# EAGLE design Puzzle_Interface (EAGLE 9.5.0)
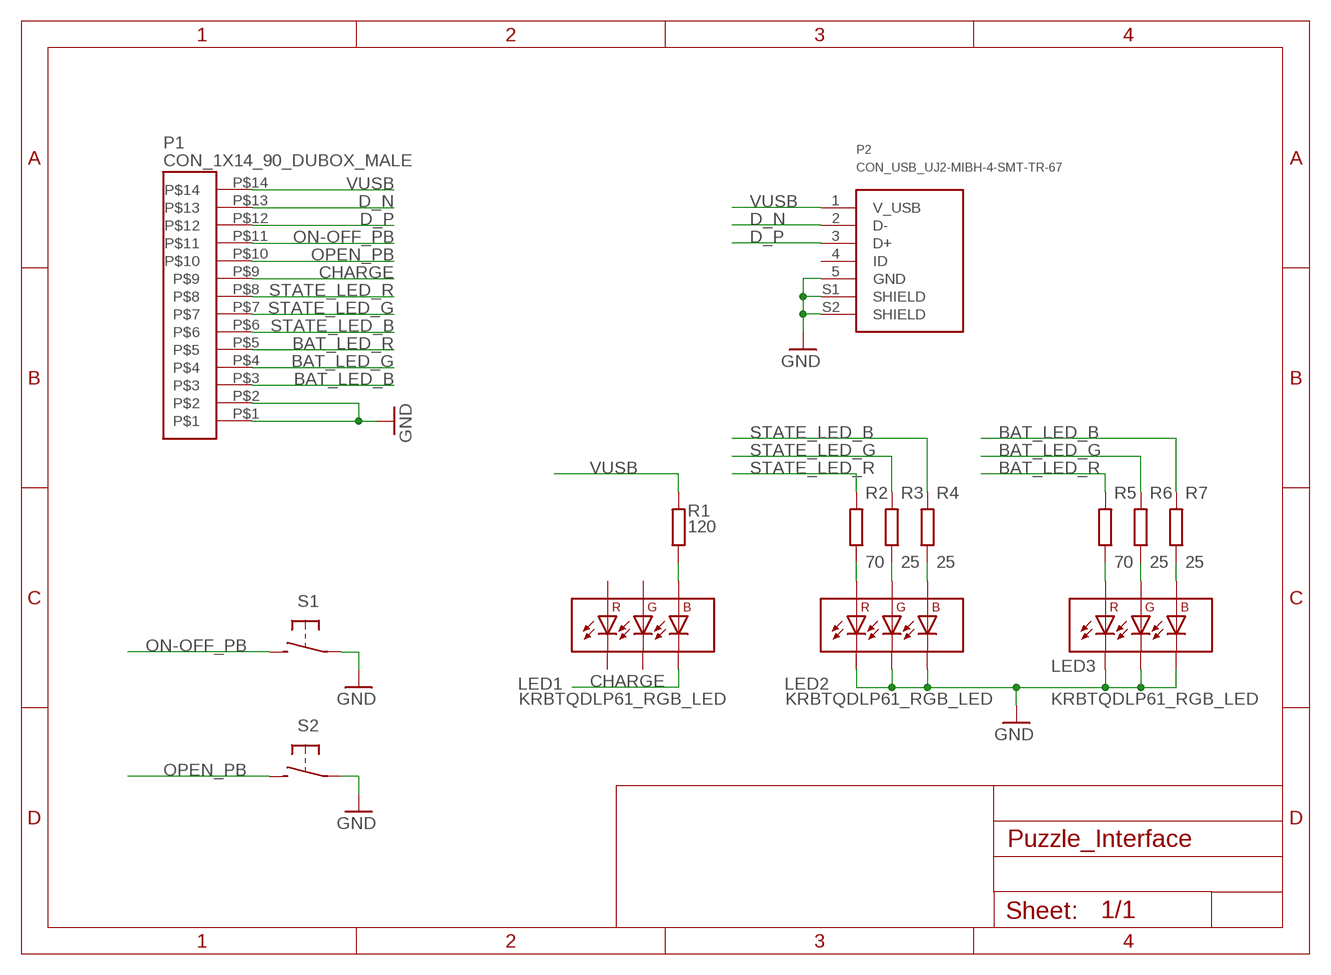
[diagram p0: schematic, sheet 1]

## Parts
LED1  KRBTQDLP61_RGB_LED  [KRBTQDLP61_RGB_LED]
LED2  KRBTQDLP61_RGB_LED  [KRBTQDLP61_RGB_LED]
LED3  KRBTQDLP61_RGB_LED  [KRBTQDLP61_RGB_LED]
P1  CON_1X14_90_DUBOX_MALE  [CON_1X14_90_DUBOX_MALE]
P2  CON_USB_UJ2-MIBH-4-SMT-TR-67  [CON_USB_UJ2-MIBH-4-SMT-TR-67]
R1  120  RES_0603  [0603]
R2  70  RES_0603  [0603]
R3  25  RES_0603  [0603]
R4  25  RES_0603  [0603]
R5  70  RES_0603  [0603]
R6  25  RES_0603  [0603]
R7  25  RES_0603  [0603]
S1  EG5358CT-ND_PB  [EG5358CT-ND_PB]
S2  EG5358CT-ND_PB  [EG5358CT-ND_PB]

## Nets
BAT_LED_B: P1.P$3 R7.2
BAT_LED_G: P1.P$4 R6.2
BAT_LED_R: P1.P$5 R5.2
CHARGE: LED1.P$4(BC) P1.P$9
D_N: P1.P$13 P2.2(D-)
D_P: P1.P$12 P2.3(D+)
GND: LED2.P$3(GC) LED2.P$4(BC) LED2.P$6(RC) LED3.P$3(GC) LED3.P$4(BC) LED3.P$6(RC) P1.P$1 P1.P$2 P2.5(GND) P2.S1(SHIELD) P2.S2(SHIELD) S1.1(P) S1.S1(P) S1.S2(P) S2.1(P) S2.S1(P) S2.S2(P)
N$1: LED1.P$2(BA) R1.1
N$5: LED2.P$5(RA) R2.1
N$6: LED2.P$1(GA) R3.1
N$7: LED2.P$2(BA) R4.1
N$11: LED3.P$5(RA) R5.1
N$12: LED3.P$1(GA) R6.1
N$13: LED3.P$2(BA) R7.1
ON-OFF_PB: P1.P$11 S1.2(S)
OPEN_PB: P1.P$10 S2.2(S)
STATE_LED_B: P1.P$6 R4.2
STATE_LED_G: P1.P$7 R3.2
STATE_LED_R: P1.P$8 R2.2
VUSB: P1.P$14 P2.1(V_USB) R1.2
Unconnected: LED1.P$1(GA) LED1.P$3(GC) LED1.P$5(RA) LED1.P$6(RC) P2.4(ID)

## Library data of the parts
LED1-LED3 = ZHAW_BA:KRBTQDLP61_RGB_LED: RGB LED, 2,1V Rot, 3,2V Grün, 2,9V Blau @ 20mA KRBT QDLP61.3A-5B5C-CF DigiKey: Pt.Nr: 475-3482-1-ND https://www.digikey.ch/product-detail/de/osram-opto-semiconductors-inc/KRBT-QDLP61-3A-5B5C-CF/475-3482-1-ND/7907970
P1 = ZHAW_BA:CON_1X14_90_DUBOX_MALE: Dubox, 1x14Pin, 2.54 Raster DigiKey: Pt.Nr: 609-1290-ND https://www.digikey.ch/product-detail/de/amphenol-icc-fci/76382-314LF/609-1290-ND/1001604 NOTE: Gegenstück: 65240-014LF
P2 = ZHAW_BA:CON_USB_UJ2-MIBH-4-SMT-TR-67: Micro B USB Buchse, 90° PCB Mount UJ2-MIBH-4-SMT-TR-67 DigiKey: Pt.Nr: 102-4970-1-ND https://www.digikey.ch/product-detail/de/cui-devices/UJ2-MIBH-4-SMT-TR-67/102-4970-1-ND/9564435
R1-R7 = ZHAW_BA:RES_0603: Resistor, 0603, 0.1 W, +-1%
S1 S2 = ZHAW_BA:EG5358CT-ND_PB: Push Button, 90° PCB Mount, TL3360CF185Q DigiKey: Pt.Nr: EG5358CT-ND https://www.digikey.ch/product-detail/de/e-switch/TL3360CF185Q/EG5358CT-ND/5816203

## Board
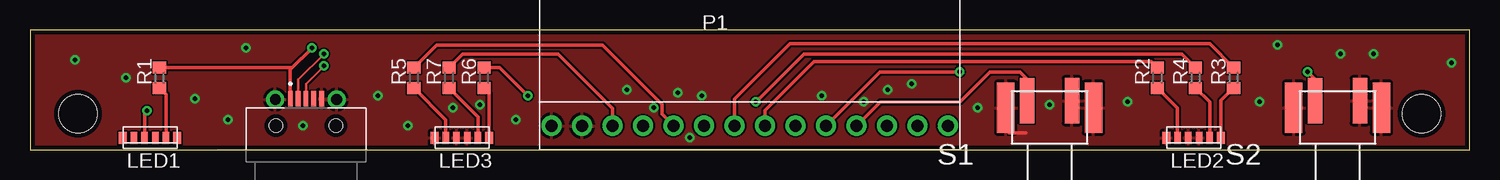
[diagram p1: board, top side]
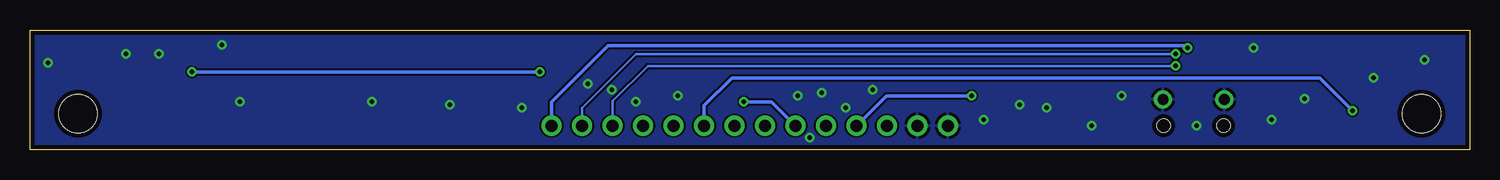
[diagram p2: board, bottom side, seen from below]

Size 120 x 10 mm. Coordinates in mm from the lower left corner, seen from the top.
Outline: 0,0 120,0 120,10 0,10 0,0
Copper layers (1*16): Top 0.035mm / dielectric 1.5mm / Bottom 0.035mm
Design rules "default *": minimum track width 6mil, minimum drill 0.35mm, track to track 6mil, track to pad 6mil, pad to pad 6mil, via to via 6mil, smd to smd 4mil, copper to edge 15mil, drill to drill 5mil, minimum pad ring 10mil, minimum via ring 8mil, stop-mask expansion 4mil, vias tented up to drill 0mil, thermal gap 10mil
Holes 3.2 mm at 4,3 116,3

### Footprints (pad centres in the part's own frame; a part is rotated, then mirrored left to right if it is on the bottom)
KRBTQDLP61_RGB_LED = smd 0.65 x 1: P$1 -2.275,0; P$6 2.275,0 | smd 0.55 x 1: P$2 -1.335,0; P$3 -0.445,0; P$4 0.445,0; P$5 1.335,0
CON_1X14_90_DUBOX_MALE = drill 1 pad 1.676: P$1 -16.51,0; P$2 -13.97,0; P$3 -11.43,0; P$4 -8.89,0; P$5 -6.35,0; P$6 -3.81,0; P$7 -1.27,0; P$8 1.27,0; P$9 3.81,0; P$10 6.35,0; P$11 8.89,0; P$12 11.43,0; P$13 13.97,0; P$14 16.51,0
CON_USB_UJ2-MIBH-4-SMT-TR-67 = smd 1.3 x 0.4: 1 4.25,1.3; 2 4.25,0.65; 3 4.25,0; 4 4.25,-0.65; 5 4.25,-1.3 | drill 0.9 pad 1.5: S1 4.2,2.55; S2 4.2,-2.55 | hole 1.1: 2,2.5; 2,-2.5
0603 = smd 1 x 1.1: 1 -0.85,0; 2 0.85,0
EG5358CT-ND_PB = smd 1.2 x 3.76: 1 -1.87,-3.58; 2 1.87,-3.58 | smd 1.46 x 4.19: S1 -3.65,-3; S2 3.65,-3

### Placement (x,y rotation side)
LED1  10,1 180 top
LED2  97,1 180 top
LED3  36,1 180 top
P1  60,2 0 top
P2  23,0 90 top
R1  10.79,6 90 top
R2  93.98,6 90 top
R3  100.33,6 90 top
R4  97.16,6 90 top
R5  32,6 90 top
R6  37.85,6 90 top
R7  34.92,6 90 top
S1  85,0.5 180 top
S2  109,0.5 180 top

### Tracks (layer width: path | path; a pad name or v marks a point on that pad's centre or on a via)
BAT_LED_B
  Top 0.3: P1.P$3 48.57,3.43 44,8 36.08,8 R7.2
BAT_LED_G  (via drill 0.35)
  Top 0.3: R6.2 39.15,6.85 v41.5,4.5
  Bottom 0.3: P1.P$4 48.61,4.5 v41.5,4.5
BAT_LED_R
  Top 0.3: P1.P$5 52.68,2.97 52.68,3.78 47.71,8.75 33.9,8.75 R5.2
CHARGE  (via drill 0.35)
  Top 0.3: LED1.P$4 9.55,3.06 v9.75,3.25
  Bottom 0.3: v9.75,3.25 12.5,6 61.5,6 63.81,3.69 P1.P$9
D_N  (via drill 0.35)
  Top 0.2: P2.2 22.35,5.85 v24.5,8
  Bottom 0.2: v24.5,8 69.5,8 74,3.5 74,2.03 P1.P$13
D_P  (via drill 0.35)
  Top 0.2: P2.3 23,5.5 v24.5,7
  Bottom 0.2: v24.5,7 68.5,7 71.43,4.07 P1.P$12
GND  (via drill 0.35)
  Top 0.3: S1.S2 81.35,1.65 81.6,1.4 83,1.4
  other vias: 112,8 102.5,4 91.5,4 79,3.5 73.5,5.5 69.5,4 66,4.5 56,4.5 52,3.5 40.5,2.5 29,4.5 8,6 16.5,2.5 71.5,5 85,3.75 104,8.75 109.25,8 118.5,7.25 54,4.75 55,1 49.75,5 35.25,3.5 37.5,3.75 31.5,2 18,8.5 22.75,2 3.75,7.5 13.75,4.25
  pour Bottom: -3.5,11 -3.5,-2.5 123.5,-2.5 123.5,11
  pour Top: -5.5,12 -5.5,-1 121,-1 121,12
N$1
  Top 0.3: R1.1 11.34,4.61 LED1.P$2
N$5
  Top 0.3: LED2.P$5 95.67,3.46 R2.1
N$6
  Top 0.3: LED2.P$1 99.28,4.09 R3.1
N$7
  Top 0.3: LED2.P$2 98.33,3.97 R4.1
N$11
  Top 0.3: LED3.P$5 34.66,2.48 R5.1
N$12
  Top 0.3: R6.1 38.27,4.72 LED3.P$1
N$13
  Top 0.3: R7.1 37.34,2.74 LED3.P$2
ON-OFF_PB
  Top 0.3: P1.P$11 70.89,4 77.5,4 80,6.5 82.5,6.5 83.13,5.87 S1.2
OPEN_PB  (via drill 0.35)
  Top 0.3: v77.5,6.5 70.85,6.5 P1.P$10 | v106.5,6.5 107.13,5.87 S2.2
  Bottom 0.3: v106.5,6.5 v77.5,6.5
STATE_LED_B  (via drill 0.35)
  Top 0.3: R4.2 96,8 64.5,8 v60.5,4
  Bottom 0.3: v60.5,4 58.19,4 P1.P$6
STATE_LED_G
  Top 0.3: R3.2 98.35,8.83 63.33,8.83 58.73,4.23 P1.P$7
STATE_LED_R
  Top 0.3: R2.2 93.48,7.35 65.35,7.35 61.27,3.27 P1.P$8
VUSB  (via drill 0.35)
  Top 0.3: P2.1 21.7,6.7 v23.5,8.5 21.85,6.85 R1.2
  Bottom 0.3: v23.5,8.5 23.68,8.68 71.82,8.68 76.51,3.99 P1.P$14

### Text on the board
tStop: TOP
bStop: BOT | Puzzle_Interface v1